# EAGLE schematic temp_eth (EAGLE 6.2)
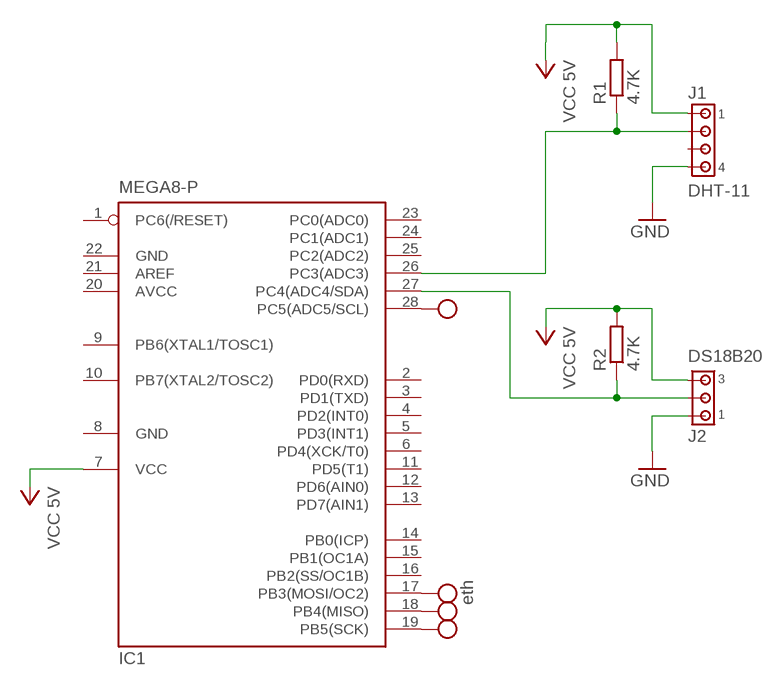
[diagram p0: schematic, sheet 1]

## Parts
IC1  MEGA8-P  [DIL28-3]
J1  DHT-11  1445055-4  [1445055-4]
J2  DS18B20  1445055-3  [1445055-3]
R1  4.7K  R-EU_0204/7  [0204/7]
R2  4.7K  R-EU_0204/7  [0204/7]

## Nets
GND: J1.4 J2.1
N$1: IC1.27(PC4(ADC4/SDA)) J2.2 R2.1
N$2: IC1.26(PC3(ADC3)) J1.2 R1.1
VCC: IC1.7(VCC) IC1.17(PB3(MOSI/OC2)) IC1.18(PB4(MISO)) IC1.19(PB5(SCK)) IC1.28(PC5(ADC5/SCL)) J1.1 J2.3 R1.2 R2.2 ; supply symbol labelled VCC 5V, D7, eth, to eth
Unconnected: IC1.1(PC6(/RESET)) IC1.2(PD0(RXD)) IC1.3(PD1(TXD)) IC1.4(PD2(INT0)) IC1.5(PD3(INT1)) IC1.6(PD4(XCK/T0)) IC1.9(PB6(XTAL1/TOSC1)) IC1.10(PB7(XTAL2/TOSC2)) IC1.11(PD5(T1)) IC1.12(PD6(AIN0)) IC1.13(PD7(AIN1)) IC1.14(PB0(ICP)) IC1.15(PB1(OC1A)) IC1.16(PB2(SS/OC1B)) IC1.21(AREF) IC1.23(PC0(ADC0)) IC1.24(PC1(ADC1)) IC1.25(PC2(ADC2)) J1.3

## Power pins joined to a net without a drawn wire
AVCC: IC1.20(AVCC)
GND: IC1.8(GND) IC1.22(GND)

## Library data of the parts
IC1 = atmel:MEGA8-P: MICROCONTROLLER 8 Kbytes FLASH, 1 kbytes SRAM, 512 bytes EEPROM, USART, 4-channel 10 bit ADC, 2-channel 8 bit ADC Pin compatible with Atmega48, ATMega88, ATMega168 Source: avr.lbr; OC_FARNELL: unknown; OC_NEWARK: unknown
J1 = con-amp:1445055-4: Micro MATE-N-LOK Connectors grid 1.5 mm Source: ENG_CD_1445055_A.pdf
J2 = con-amp:1445055-3: Micro MATE-N-LOK Connectors grid 1.5 mm Source: ENG_CD_1445055_A.pdf
R1 R2 = resistor:R-EU_: RESISTOR, European symbol